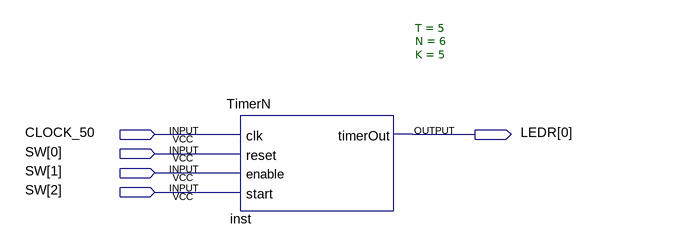
[diagram p0: schematic sheet]
// Quartus schematic TimerN_Demo.bdf as structural Verilog: 1 symbols, 5 pins
module TimerN_Demo (
  input  CLOCK_50,
  input  [2:0] SW,
  output [0:0] LEDR
);

  TimerN #(.T(5), .N(6), .K(5)) inst (.clk(CLOCK_50), .reset(SW[0]), .enable(SW[1]), .start(SW[2]), .timerOut(LEDR[0]));
endmodule
